# Altium schematic sheet 1_Power.SchDoc
size A4; SheetNumber: 1; SheetTotal: 4
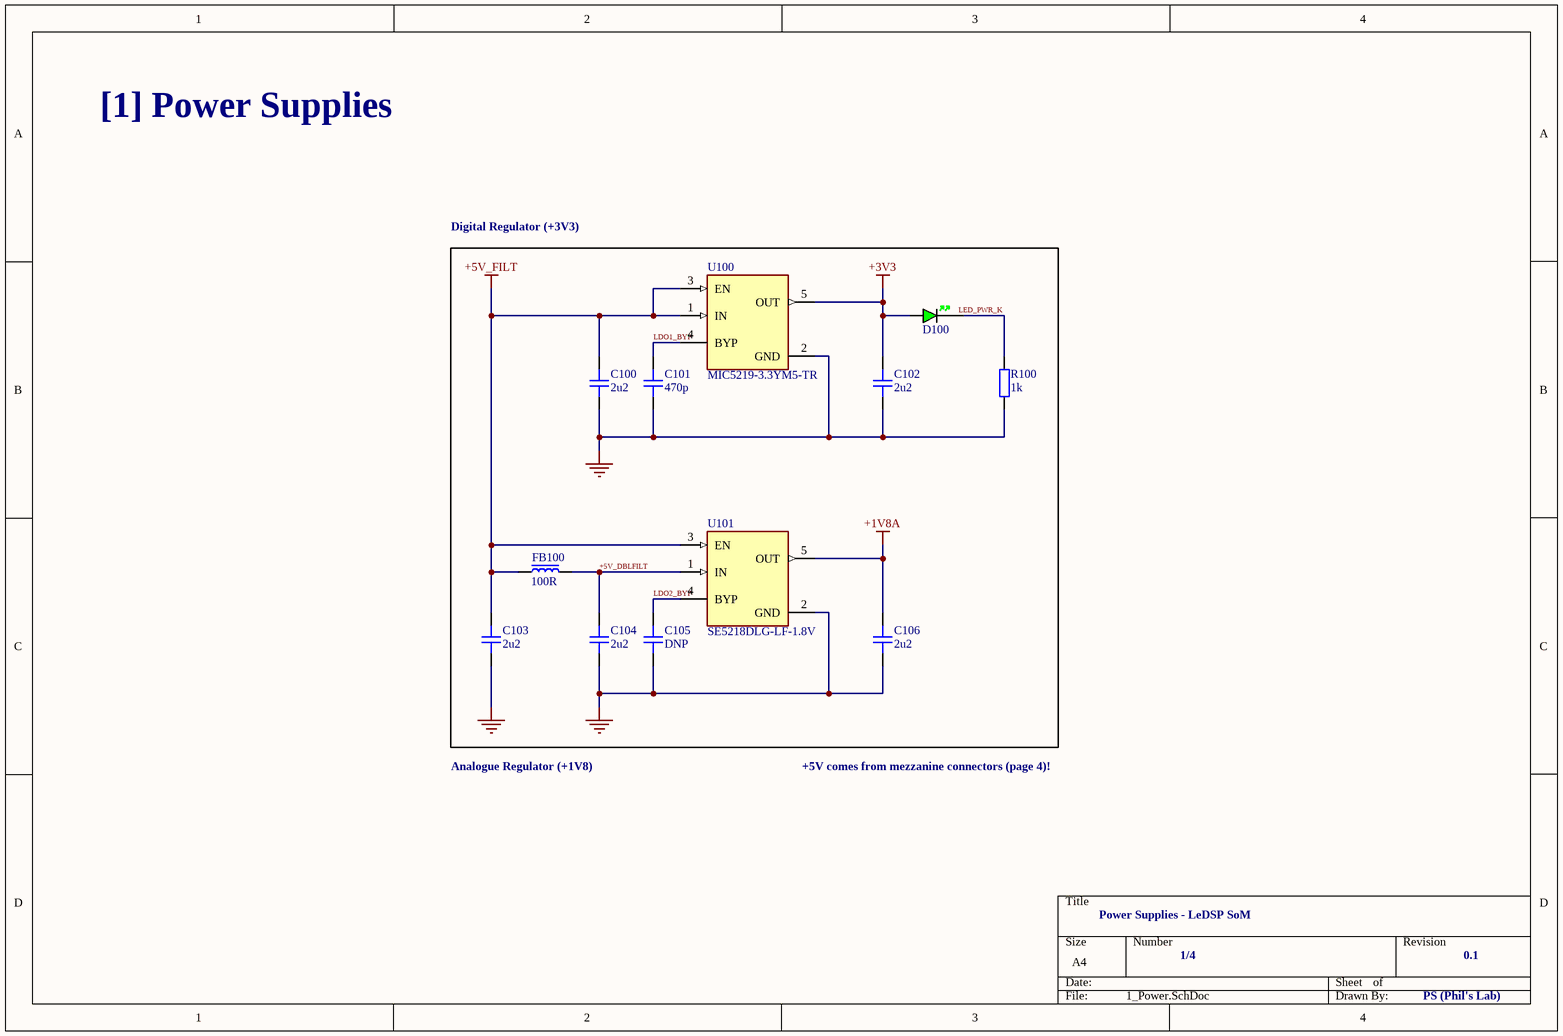
[diagram p0: 1_Power.SchDoc]

## Parts
C100  2u2  [CAP_0603]
C101  470p  [CAP_0402]
C102  2u2  [CAP_0603]
C103  2u2  [CAP_0603]
C104  2u2  [CAP_0603]
C105  DNP  [CAP_0402]
C106  2u2  [CAP_0603]
D100  GREEN  [LED_0402_GREEN]  (value not drawn)
FB100  100R  [FB_0603]
R100  1k  [RES_0402]
U100  MIC5219-3.3YM5-TR  [FP-SOT23-5LD-PL-1-IPC_A]
U101  SE5218DLG-LF-1.8V  [FP-SOT23-5LD-PL-1-IPC_A]

## Blocks framed on the sheet
Digital Regulator (+3V3): C100-C106 D100 FB100 R100 U100 U101

## Nets
+1V8A: C106.2 U101.5(OUT)
+3V3: C102.2 D100.A U100.5(OUT)
+5V_FILT: C100.2 C103.2 FB100.1 U100.1(IN) U100.3(EN) U101.3(EN)
GND: C100.1 C101.1 C102.1 C103.1 C104.1 C105.1 C106.1 R100.1 U100.2(GND) U101.2(GND)
+5V_DBLFILT: C104.2 FB100.2 U101.1(IN)
LDO1_BYP: C101.2 U100.4(BYP)
LDO2_BYP: C105.2 U101.4(BYP)
LED_PWR_K: D100.K R100.2

## Notes on the sheet
- [1] Power Supplies
- Analogue Regulator (+1V8)
- +5V comes from mezzanine connectors (page 4)!
- Power Supplies - LeDSP SoM
- 1/4
- 0.1
- PS (Phil's Lab)

## Library data of the parts
C100 C102-C104 C106 = CAP_0603_16V: Capacitor SMD 0603 16V
C101 C105 = CAP_0402_16V: Capacitor SMD 0402 16V
D100 = LED_0402_GREEN: LED 0402 GREEN SMD
FB100 = FB_0603: Ferrite Bead SMD 0603
R100 = RES_0402: Resistor SMD 0402
U100 U101 = CMP-06324-000027-1: IC REG LINEAR 3.3V 500MA SOT23-5; Dropout Voltage: 350mV; Output Type: Fixed; Number of Regulators: 1; Max Input Voltage: 12V; Min Input Voltage: 2.5V; Min Operating Temperature: -40°C; Nominal Output Voltage: 3.3V; Output Voltage: 3.3V; Packaging: Cut Tape; Mount: Surface Mount; Number of Pins: 5; Case/Package: SOT-23-5; Lead Free: Lead Free; Max Operating Temperature: 125°C; REACH SVHC: No SVHC; Output Current: 500mA